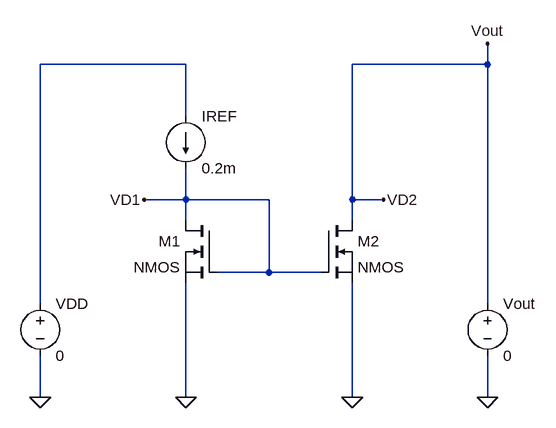
[diagram p0: schematic Chapter05A_01.fig.asc]
Chapter05A_01.fig.asc, the LTspice schematic file:
Version 4
SHEET 1 880 680
WIRE 96 -160 -128 -160
WIRE 560 -160 560 -192
WIRE 560 -160 352 -160
WIRE 96 -80 96 -160
WIRE 96 48 96 0
WIRE 96 48 32 48
WIRE 224 48 96 48
WIRE 352 48 352 -160
WIRE 400 48 352 48
WIRE 96 80 96 48
WIRE 352 80 352 48
WIRE 224 160 224 48
WIRE 224 160 144 160
WIRE 304 160 224 160
WIRE -128 208 -128 -160
WIRE 560 208 560 -160
WIRE -128 352 -128 288
WIRE 96 352 96 176
WIRE 352 352 352 176
WIRE 560 352 560 288
FLAG -128 352 0
FLAG 560 352 0
FLAG 96 352 0
FLAG 352 352 0
FLAG 560 -192 Vout
FLAG 400 48 VD2
FLAG 32 48 VD1
SYMBOL nmos 144 80 M0
SYMATTR InstName M1
SYMBOL nmos 304 80 R0
SYMATTR InstName M2
SYMBOL voltage -128 192 R0
WINDOW 123 0 0 Left 0
WINDOW 39 0 0 Left 0
SYMATTR InstName VDD
SYMATTR Value 0
SYMBOL voltage 560 192 R0
WINDOW 123 0 0 Left 0
WINDOW 39 0 0 Left 0
SYMATTR InstName Vout
SYMATTR Value 0
SYMBOL current 96 -80 R0
WINDOW 123 0 0 Left 0
WINDOW 39 0 0 Left 0
SYMATTR InstName IREF
SYMATTR Value 0.2m

The netlist it stands for:
* Chapter05A_01.fig.asc
M1 VD1 VD1 0 0 NMOS
M2 VD2 VD1 0 0 NMOS
VDD N001 0 0
Vout VD2 0 0
IREF N001 VD1 0.2m
.model NMOS NMOS
.model PMOS PMOS
.lib standard.mos
.backanno
.end